# EAGLE design shield (EAGLE 7.7.0)
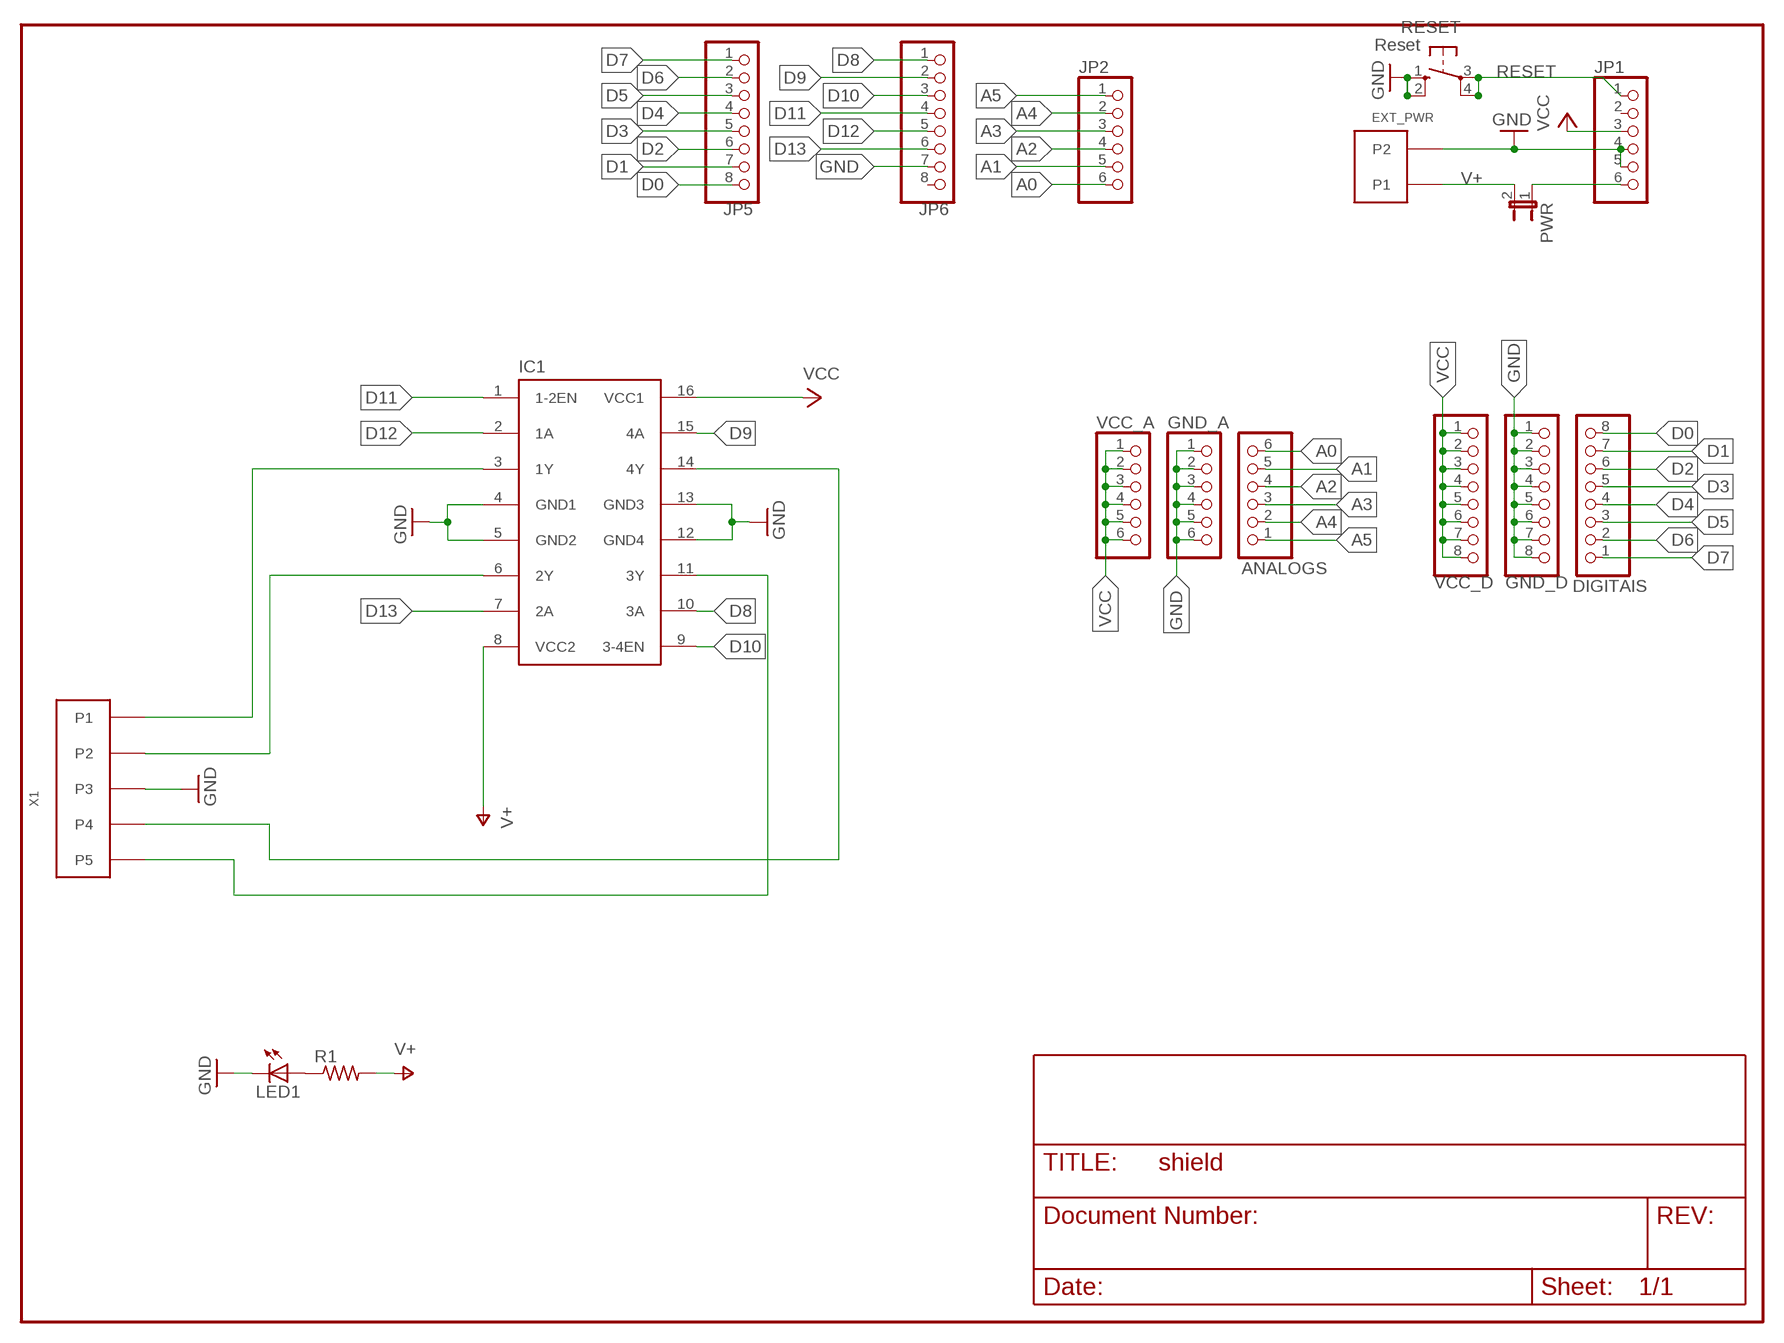
[diagram p0: schematic, sheet 1]

## Parts
ANALOGS  PINHD-1X6  [1X06]
DIGITAIS  PINHD-1X8  [1X08]
EXT_PWR  PINHEAD  [TERMBLOCK508]
GND_A  PINHD-1X6  [1X06]
GND_D  PINHD-1X8  [1X08]
IC1  L293E  [DIL16]
JP1  PINHD-1X6  [1X06]
JP2  PINHD-1X6  [1X06]
JP5  PINHD-1X8  [1X08]
JP6  PINHD-1X8  [1X08]
LED1  LED3MM  [LED3MM]
PWR  JP1E  [JP1]
R1  R-US_0207/10  [0207/10]
RESET  Reset  10-XX  [B3F-10XX]
VCC_A  PINHD-1X6  [1X06]
VCC_D  PINHD-1X8  [1X08]
X1  TERM5  [TERM1X5]

## Nets
9V: JP1.6 PWR.1
A0: ANALOGS.6 JP2.6
A1: ANALOGS.5 JP2.5
A2: ANALOGS.4 JP2.4
A3: ANALOGS.3 JP2.3
A4: ANALOGS.2 JP2.2
A5: ANALOGS.1 JP2.1
D0: DIGITAIS.8 JP5.8
D1: DIGITAIS.7 JP5.7
D2: DIGITAIS.6 JP5.6
D3: DIGITAIS.5 JP5.5
D4: DIGITAIS.4 JP5.4
D5: DIGITAIS.3 JP5.3
D6: DIGITAIS.2 JP5.2
D7: DIGITAIS.1 JP5.1
D8: IC1.10(3A) JP6.1
D9: IC1.15(4A) JP6.2
D10: IC1.9(3-4EN) JP6.3
D11: IC1.1(1-2EN) JP6.4
D12: IC1.2(1A) JP6.5
D13: IC1.7(2A) JP6.6
GND [power]: EXT_PWR.P$4(P2) GND_A.1 GND_A.2 GND_A.3 GND_A.4 GND_A.5 GND_A.6 GND_D.1 GND_D.2 GND_D.3 GND_D.4 GND_D.5 GND_D.6 GND_D.7 GND_D.8 IC1.4(GND1) IC1.5(GND2) IC1.12(GND4) IC1.13(GND3) JP1.4 JP1.5 JP6.7 LED1.K(C) RESET.1(S) RESET.2(S1) X1.P3
N$1: IC1.3(1Y) X1.P1
N$31: IC1.6(2Y) X1.P2
N$32: IC1.11(3Y) X1.P5
N$33: IC1.14(4Y) X1.P4
N$35: LED1.A R1.1
RESET: JP1.1 RESET.3(P) RESET.4(P1)
V+: EXT_PWR.P$3(P1) IC1.8(VCC2) PWR.2 R1.2
VCC: IC1.16(VCC1) JP1.3 VCC_A.1 VCC_A.2 VCC_A.3 VCC_A.4 VCC_A.5 VCC_A.6 VCC_D.1 VCC_D.2 VCC_D.3 VCC_D.4 VCC_D.5 VCC_D.6 VCC_D.7 VCC_D.8
Unconnected: JP1.2 JP6.8

## Library data of the parts
ANALOGS GND_A JP1 JP2 VCC_A = pinhead:PINHD-1X6: PIN HEADER
DIGITAIS GND_D JP5 JP6 VCC_D = pinhead:PINHD-1X8: PIN HEADER
EXT_PWR = mshield:PINHEAD
IC1 = texas:L293E: TI DEVICE
LED1 = minimidi:LED: LED OSRAM: - CHIPLED LG R971, LG N971, LY N971, LG Q971, LY Q971, LO R971, LY R971 LH N974, LH R974 LS Q976, LO Q976, LY Q976 LO Q996 - Hyper CHIPLED LW Q18S LB Q993, LB Q99A, LB R99A - SideLED LS A670, LO A670, LY A670, LG A670, LP A670 LB A673, LV A673, LT A673, LW A673 LH A674 LY A675 LS A676, LA A676, LO A676, LY A676, LW A676 LS A679, LY A679, LG A679 - Hyper Micro SIDELED® LS Y876, LA Y876, LO Y876, LY Y876 LT Y87S - SmartLED LW L88C, LW L88S LB L89C, LB L89S, LG L890 LS L89K, LO L89K, LY L89K LS L896, LA L896, LO L896, LY L896 - TOPLED LS T670, LO T670, LY T670, LG T670, LP T670 LSG T670, LSP T670, LSY T670, LOP T670, LYG T670 LG T671, LOG T671, LSG T671 LB T673, LV T673, LT T673, LW T673 LH T674 LS T676, LA T676, LO T676, LY T676, LB T676, LH T676, LSB T676, LW T676 LB T67C, LV T67C, LT T67C, LS T67K, LO T67K, LY T67K, LW E67C LS E67B, LA E67B, LO E67B, LY E67B, LB E67C, LV E67C, LT E67C LW T67C LS T679, LY T679, LG T679 LS T770, LO T770, LY T770, LG T770, LP T770 LB T773, LV T773, LT T773, LW T773 LH T774 LS E675, LA E675, LY E675, LS T675 LS T776, LA T776, LO T776, LY T776, LB T776 LHGB T686 LT T68C, LB T68C - Hyper Mini TOPLED® LB M676 - Mini TOPLED Santana® LG M470 LS M47K, LO M47K, LY M47K Source: http://www.osram.convergy.de/
PWR = jumper:JP1E: JUMPER
R1 = rcl-ez:R-US_: RESISTOR, American symbol
RESET = switch-omron:10-XX: OMRON SWITCH
X1 = mshield:TERM5

## Net classes
1 power: width 0.61 mm

## Board
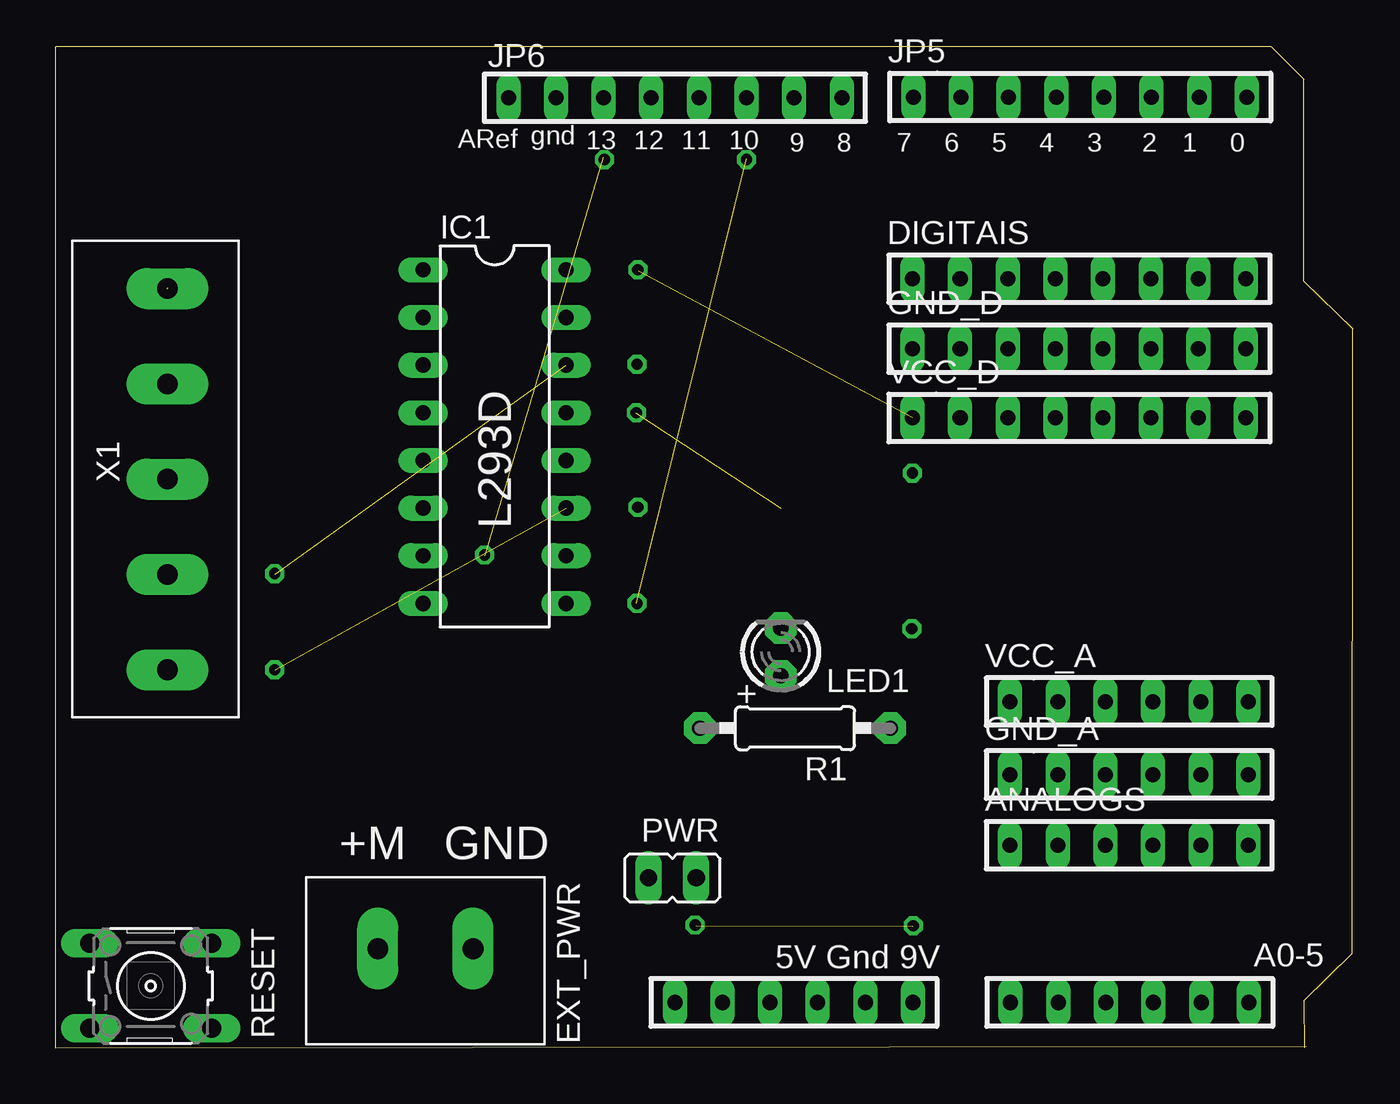
[diagram p1: board, top side]
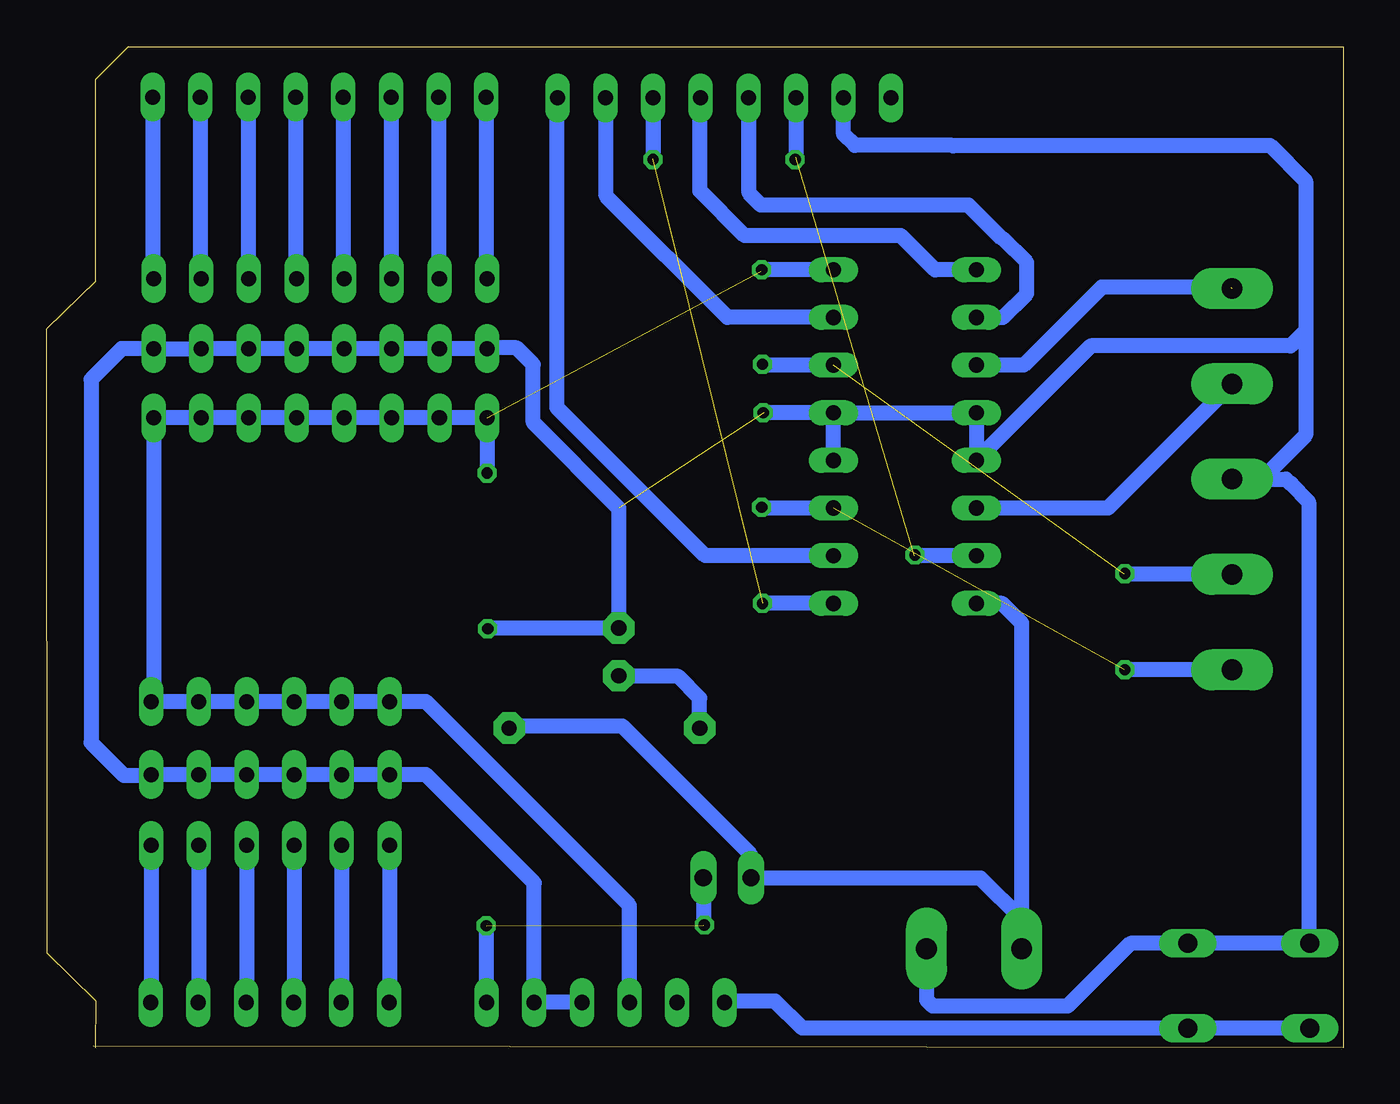
[diagram p2: board, bottom side, seen from below]

Size 69.16 x 53.35 mm. Coordinates in mm from the lower left corner, seen from the top.
Outline: 69.13,5.05 69.13,5.05
Outline: 69.13,5.05 69.16,38.33 66.55,40.87 66.55,51.63 64.83,53.35 0,53.35 0,0 66.68,0.09
Outline: 69.13,5.05 66.55,2.5 66.57,0
Copper layers (1*16): Top 0.035mm / dielectric 1.5mm / Bottom 0.035mm
Design rules "default": minimum track width 16mil, minimum drill 19mil, track to track 12mil, track to pad 12mil, pad to pad 12mil, via to via 12mil, smd to smd 0mil, copper to edge 10mil, drill to drill 8mil, minimum pad ring 10mil, minimum via ring 8mil, stop-mask expansion 4mil, vias tented up to drill 0mil, thermal gap 10mil

### Footprints (pad centres in the part's own frame; a part is rotated, then mirrored left to right if it is on the bottom)
1X06 = drill 0.8 long: 1 -6.35,0; 2 -3.81,0; 3 -1.27,0; 4 1.27,0; 5 3.81,0; 6 6.35,0
1X08 = drill 0.8 long: 1 -8.89,0; 2 -6.35,0; 3 -3.81,0; 4 -1.27,0; 5 1.27,0; 6 3.81,0; 7 6.35,0; 8 8.89,0
TERMBLOCK508 = drill 1.1 pad 2.184 long: P$3 -2.54,0; P$4 2.54,0
DIL16 = drill 0.813 long: 1 -8.89,-3.81; 2 -6.35,-3.81; 3 -3.81,-3.81; 4 -1.27,-3.81; 5 1.27,-3.81; 6 3.81,-3.81; 7 6.35,-3.81; 8 8.89,-3.81; 9 8.89,3.81; 10 6.35,3.81; 11 3.81,3.81; 12 1.27,3.81; 13 -1.27,3.81; 14 -3.81,3.81; 15 -6.35,3.81; 16 -8.89,3.81
LED3MM = drill 0.813 pad 1.676 octagon: A -1.27,0; K 1.27,0
JP1 = drill 0.914 long: 1 0,-1.27; 2 0,1.27
0207/10 = drill 0.813 pad 1.676 octagon: 1 -5.08,0; 2 5.08,0
B3F-10XX = drill 1.016 long: 1 -3.251,2.261; 2 3.251,2.261; 3 -3.251,-2.261; 4 3.251,-2.261
TERM1X5 = drill 1.1 pad 2.184 long: P1 -10.16,0; P2 -5.08,0; P3 0,0; P4 5.08,0; P5 10.16,0

### Placement (x,y rotation side)
ANALOGS  57.24,10.79 0 top
DIGITAIS  54.58,40.99 0 top
EXT_PWR  19.72,5.28 0 top
GND_A  57.24,14.56 0 top
GND_D  54.58,37.26 0 top
IC1  23.41,32.58 270 top
JP1  39.37,2.42 0 top
JP2  57.27,2.42 0 top
JP5  54.62,50.68 0 top
JP6  33.03,50.64 180 top
LED1  38.67,21.1 90 top
PWR  32.89,9.07 90 top
R1  39.43,17.04 0 top
RESET  5.08,3.31 0 top
VCC_A  57.24,18.45 0 top
VCC_D  54.58,33.57 0 top
X1  5.97,30.31 270 top

### Tracks (layer width: path | path; a pad name or v marks a point on that pad's centre or on a via)
9V  (1 unrouted)
  Bottom 0.813: JP1.6 45.72,6.49 45.73,6.51 | PWR.1 34.16,6.52 34.14,6.51
A0
  Bottom 0.813: ANALOGS.6 63.59,2.45 JP2.6
A1
  Bottom 0.813: ANALOGS.5 61.05,2.45 JP2.5
A2
  Bottom 0.813: ANALOGS.4 58.51,2.45 JP2.4
A3
  Bottom 0.813: ANALOGS.3 55.97,2.45 JP2.3
A4
  Bottom 0.813: ANALOGS.2 53.43,2.45 JP2.2
A5
  Bottom 0.813: ANALOGS.1 50.89,2.45 JP2.1
D0
  Bottom 0.813: JP5.8 63.51,41.03 DIGITAIS.8
D1
  Bottom 0.813: JP5.7 60.97,41.03 DIGITAIS.7
D2
  Bottom 0.813: JP5.6 58.43,41.03 DIGITAIS.6
D3
  Bottom 0.813: JP5.5 55.89,41.03 DIGITAIS.5
D4
  Bottom 0.813: JP5.4 53.35,41.03 DIGITAIS.4
D5
  Bottom 0.813: JP5.3 50.81,41.03 DIGITAIS.3
D6
  Bottom 0.813: JP5.2 48.27,41.03 DIGITAIS.2
D7
  Bottom 0.813: JP5.1 45.73,41.03 DIGITAIS.1
D8
  Bottom 0.813: IC1.10 34.06,26.23 41.96,34.13 41.96,50.6 JP6.1
D9
  Bottom 0.813: IC1.15 32.87,38.93 39.34,45.4 39.34,50.6 JP6.2
D10  (1 unrouted)
  Bottom 0.813: IC1.9 30.97,23.69 | JP6.3 36.84,47.38
D11
  Bottom 0.813: JP6.4 34.34,50.6 34.34,45.68 31.96,43.3 23.63,43.3 21.8,41.47 IC1.1
D12
  Bottom 0.813: IC1.2 18.19,38.93 16.92,40.2 16.92,41.87 18.19,43.14 18.23,43.14 20.01,44.92 31.09,44.92 31.72,45.56 31.72,50.6 JP6.5
D13  (1 unrouted)
  Bottom 0.813: JP6.6 29.22,47.46 | IC1.7 22.91,26.23
GND  (1 unrouted)
  Bottom 0.813: JP1.4 JP1.5 43.18,8.79 48.95,14.56 GND_A.1 GND_A.2 GND_A.3 GND_A.4 GND_A.5 GND_A.6 63.63,14.52 65.06,14.52 66.81,16.27 66.81,35.64 65.18,37.26 GND_D.8 GND_D.7 GND_D.6 GND_D.5 GND_D.4 GND_D.3 GND_D.2 GND_D.1 45.65,37.3 44.11,37.3 43.23,36.43 43.23,33.34 38.67,28.77 LED1.K 45.72,22.37 45.73,22.38 | IC1.13 IC1.4 IC1.5 13.5,37.41 2.84,37.41 2.04,38.22 | EXT_PWR.P$4 22.26,2.56 21.92,2.22 14.74,2.22 11.39,5.57 RESET.2 RESET.1 1.88,5.62 1.88,29.09 2.87,30.08 | 2.87,30.08 3.1,30.31 X1.P3 4.39,30.31 2.04,32.66 2.04,38.22 | 2.79,30.08 2.87,30.08 | 2.04,38.22 2.04,46.19 3.94,48.1 20.81,48.1 20.85,48.06 20.89,48.1 26.09,48.1 26.68,48.69 JP6.7 | IC1.13 30.93,33.85 | IC1.12 IC1.13
N$1  (1 unrouted)
  Bottom 0.813: IC1.3 17.08,36.39 12.92,40.55 6.04,40.55 6.01,40.52
N$2  (via drill 0.6)
  other vias: 29.26,47.34
N$3  (via drill 0.6)
  other vias: 31.01,23.69
N$4  (via drill 0.6)
  other vias: 31.05,41.47
N$5  (via drill 0.6)
  other vias: 45.69,30.64
N$6  (via drill 0.6)
  other vias: 22.87,26.27
N$7  (via drill 0.6)
  other vias: 11.68,20.16
N$8  (via drill 0.6)
  other vias: 36.84,47.34
N$9  (via drill 0.6)
  other vias: 31.01,36.43
N$10  (via drill 0.6)
  other vias: 34.1,6.55
N$11  (via drill 0.6)
  other vias: 45.73,6.51
N$12  (via drill 0.6)
  other vias: 31.05,28.81
N$13  (via drill 0.6)
  other vias: 11.68,25.28
N$14  (via drill 0.6)
  other vias: 30.97,33.85
N$15  (via drill 0.6)
  other vias: 45.65,22.34
N$31
  Bottom 0.813: X1.P2 12.59,28.77 IC1.6
N$32  (1 unrouted)
  Bottom 0.813: IC1.11 31.05,28.77 | X1.P5 11.71,20.15 11.72,20.16
N$33  (1 unrouted)
  Bottom 0.813: IC1.14 30.97,36.39 31.01,36.43 | X1.P4 11.71,25.23 11.72,25.24
N$35
  Bottom 0.813: R1.1 34.35,18.66 35.49,19.8 38.64,19.8 LED1.A
RESET
  Bottom 0.813: JP1.1 32.94,2.5 30.33,2.5 28.88,1.05 RESET.4 RESET.3
V+
  Bottom 0.813: R1.2 44.41,17.14 38.47,17.14 31.62,10.29 PWR.2 31.6,9.05 19.38,9.05 17.18,6.85 EXT_PWR.P$3 17.18,22.64 18.23,23.69 IC1.8
VCC  (1 unrouted)
  Bottom 0.813: JP1.3 38.1,7.6 48.95,18.45 VCC_A.1 VCC_A.2 VCC_A.3 VCC_A.4 VCC_A.5 VCC_A.6 63.47,18.57 VCC_D.8 VCC_D.7 VCC_D.6 VCC_D.5 VCC_D.4 VCC_D.3 VCC_D.2 VCC_D.1 45.69,30.6 45.73,30.56 | IC1.16 31.01,41.47 31.09,41.39

### Text on the board
tPlace: ARef | gnd | 13 | 12 | 11 | 10 | 9 | 8 | 7 | 6 | 5 | 4 | 3 | 2 | 1 | 0 | L293D | + | +M | GND | A0-5
tNames: 5V Gnd 9V